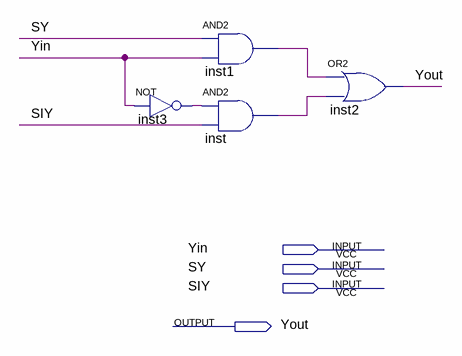
[diagram p0: schematic sheet]
// Quartus schematic alu_y_selector_1_bit.bdf as structural Verilog: 4 symbols, 4 pins
module alu_y_selector_1_bit (
  input  Yin,
  input  SY,
  input  SIY,
  output Yout
);

  wire inst1_out, inst3_out, inst_out;

  not inst3 (inst3_out, Yin);
  and inst1 (inst1_out, SY, Yin);
  and inst (inst_out, inst3_out, SIY);
  or inst2 (Yout, inst1_out, inst_out);
endmodule
